# EAGLE design coms (EAGLE 7.7.0)

## Sheet 1 of 3
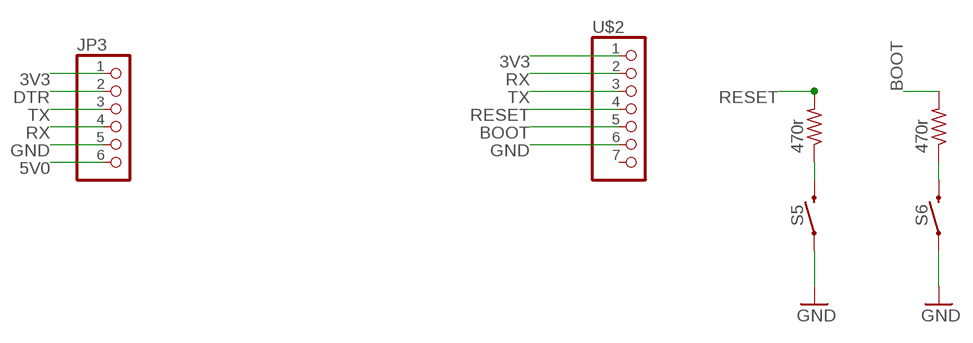
[diagram p0: schematic, sheet 1]

### Parts
JP3  HEADER-1X6ROUND  [1X06_ROUND]
R5  470r  R-US_M1206  [M1206]
R6  470r  R-US_M1206  [M1206]
S5  MOMENTARY-SWITCH-SPST  [TACTILE_SWITCH_C480275]
S6  MOMENTARY-SWITCH-SPST  [TACTILE_SWITCH_C480275]
U$2  HEADER-1X7ROUND  [1X07_ROUND]

### Nets
3V3: JP3.1 U$2.1 ; also sheet 2,3
5V0: JP3.6 ; also sheet 2,3
BOOT: R6.2 U$2.5 ; also sheet 2,3
DTR: JP3.2 ; also sheet 2,3
GND: JP3.5 S5.1 S5.2 S6.1 S6.2 U$2.6 ; also sheet 2,3
N$5: R5.1 S5.3 S5.4
N$6: R6.1 S6.3 S6.4
RESET: R5.2 U$2.4 ; also sheet 2,3
RX: JP3.4 U$2.2 ; also sheet 2,3
TX: JP3.3 U$2.3 ; also sheet 2,3
Unconnected: U$2.7

## Sheet 2 of 3
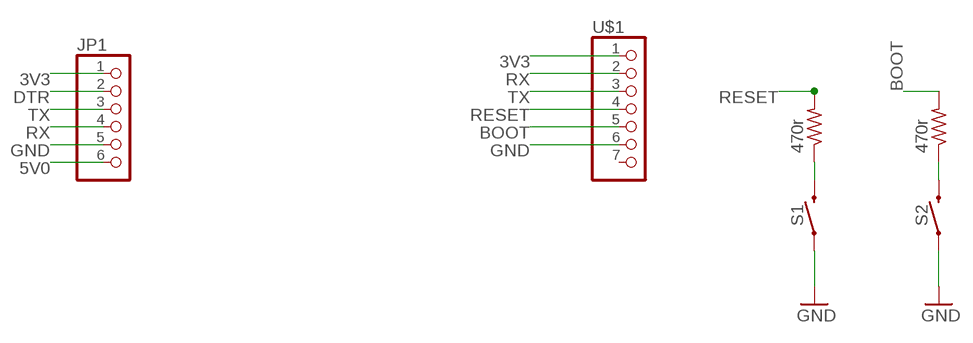
[diagram p1: schematic, sheet 2]

### Parts
JP1  HEADER-1X6ROUND  [1X06_ROUND]
R1  470r  R-US_M1206  [M1206]
R2  470r  R-US_M1206  [M1206]
S1  MOMENTARY-SWITCH-SPST  [TACTILE_SWITCH_C480275]
S2  MOMENTARY-SWITCH-SPST  [TACTILE_SWITCH_C480275]
U$1  HEADER-1X7ROUND  [1X07_ROUND]

### Nets
3V3: JP1.1 U$1.1 ; also sheet 1,3
5V0: JP1.6 ; also sheet 1,3
BOOT: R2.2 U$1.5 ; also sheet 1,3
DTR: JP1.2 ; also sheet 1,3
GND: JP1.5 S1.1 S1.2 S2.1 S2.2 U$1.6 ; also sheet 1,3
N$1: R1.1 S1.3 S1.4
N$2: R2.1 S2.3 S2.4
RESET: R1.2 U$1.4 ; also sheet 1,3
RX: JP1.4 U$1.2 ; also sheet 1,3
TX: JP1.3 U$1.3 ; also sheet 1,3
Unconnected: U$1.7

## Sheet 3 of 3
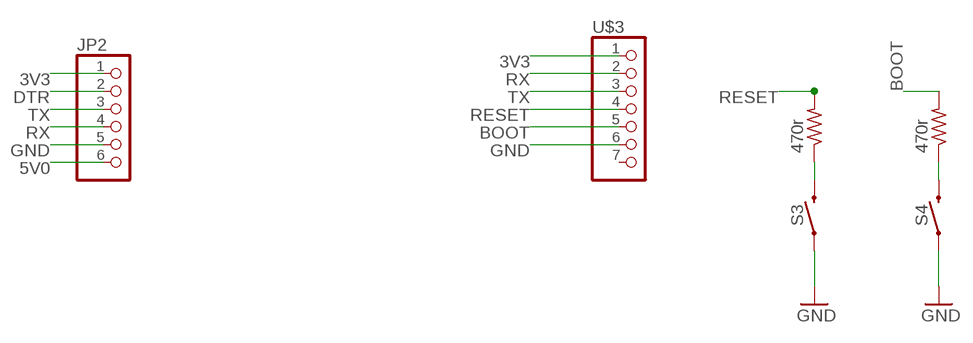
[diagram p2: schematic, sheet 3]

### Parts
JP2  HEADER-1X6ROUND  [1X06_ROUND]
R3  470r  R-US_M1206  [M1206]
R4  470r  R-US_M1206  [M1206]
S3  MOMENTARY-SWITCH-SPST  [TACTILE_SWITCH_C480275]
S4  MOMENTARY-SWITCH-SPST  [TACTILE_SWITCH_C480275]
U$3  HEADER-1X7ROUND  [1X07_ROUND]

### Nets
3V3: JP2.1 U$3.1 ; also sheet 1,2
5V0: JP2.6 ; also sheet 1,2
BOOT: R4.2 U$3.5 ; also sheet 1,2
DTR: JP2.2 ; also sheet 1,2
GND: JP2.5 S3.1 S3.2 S4.1 S4.2 U$3.6 ; also sheet 1,2
N$3: R3.1 S3.3 S3.4
N$4: R4.1 S4.3 S4.4
RESET: R3.2 U$3.4 ; also sheet 1,2
RX: JP2.4 U$3.2 ; also sheet 1,2
TX: JP2.3 U$3.3 ; also sheet 1,2
Unconnected: U$3.7

## Library data of the parts
JP1-JP3 = microbuilder:HEADER-1X6: PIN HEADER
R1-R6 = rcl:R-US_: RESISTOR, American symbol
S1-S6 = SparkFun-Switches:MOMENTARY-SWITCH-SPST: Momentary Switch (Pushbutton) - SPST Normally-open (NO) SPST momentary switches (buttons, pushbuttons). Variants PTH-12MM - 12mm square, through-hole Momentary Pushbutton Switch - 12mm Square <https://www.sparkfun.com/products/9190> (COM-09190) PTH-6.0MM, PTH-6.0MM-KIT - 6.0mm square, through-hole Mini Pushbutton Switch <https://www.sparkfun.com/products/97> (COM-00097) KIT package intended for soldering kit's - only one side of pads' copper is exposed. PTH-RIGHT-ANGLE-KIT - Right-angle, through-hole Right Angle Tactile Button <https://www.sparkfun.com/products/10791> - Used on SparkFun BigTime Watch Kit <https://www.sparkfun.com/products/11734> SMD-12MM - 12mm square, surface-mount Tactile Button - SMD (12mm) <https://www.sparkfun.com/products/12993> (COM-12993) Used on SparkFun PicoBoard <https://www.sparkfun.com/products/11888> SMD-4.5MM - 4.5mm Square Trackball Switch Used on SparkFun Blackberry Trackballer Breakout <https://www.sparkfun.com/products/13169> SMD-4.6MMX2.8MM - 4.60mm x 2.80mm, surface mount Used on SparkFun SAMD21 Mini Breakout <https://www.sparkfun.com/products/13664> SMD-5.2MM, SMD-5.2-REDUNDANT - 5.2mm square, surface-mount Mini Pushbutton Switch - SMD <https://www.sparkfun.com/products/8720> (COM-08720) Used on Arduino Pro Mini <https://www.sparkfun.com/products/11114> REDUNDANT package connects both switch circuits together SMD-6.0X3.5MM - 6.0 x 3.5mm, surface mount Momentary Reset Switch SMD <https://www.sparkfun.com/products/8229> (COM-08229) SMD-6.2MM-TALL - 6.2mm square, surface mount Tactile Button - SMD (6mm) <https://www.sparkfun.com/products/12992> Used on SparkFun Digital Sandbox <https://www.sparkfun.com/products/12651> SMD-RIGHT-ANGLE - Right-angle, surface mount Used on SparkFun Block for Intel® Edison - Arduino <https://www.sparkfun.com/products/13036>
U$1-U$3 = microbuilder:HEADER-1X7: PIN HEADER

## Net classes
0 default: width 0.254 mm, drill 0.305 mm, clearance 0.152 mm

## Board
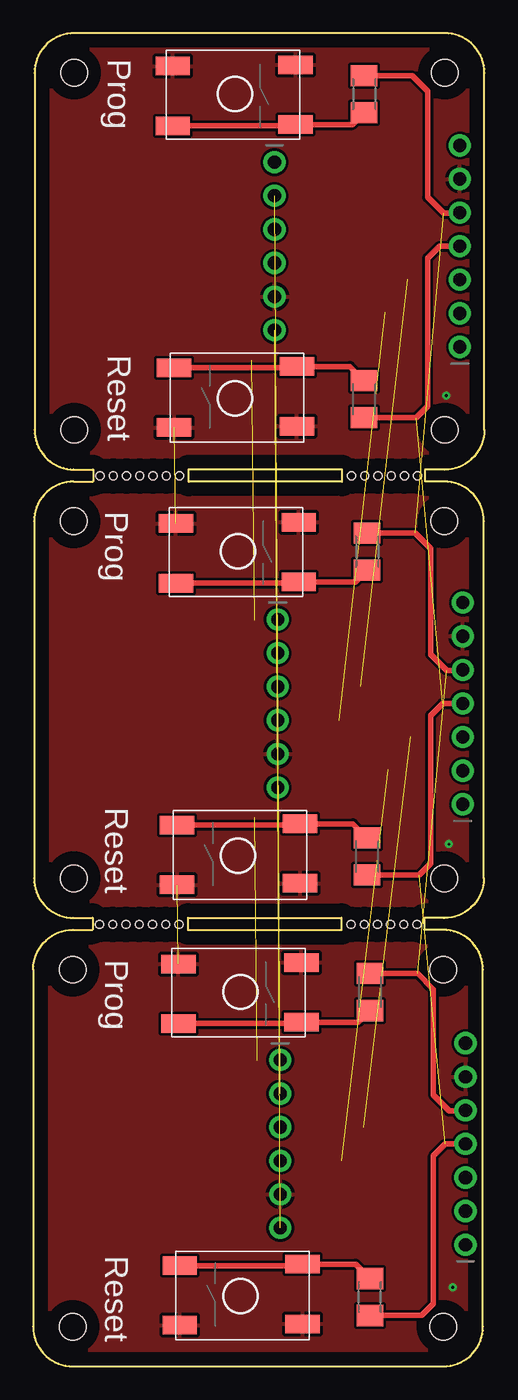
[diagram p3: board, top side]
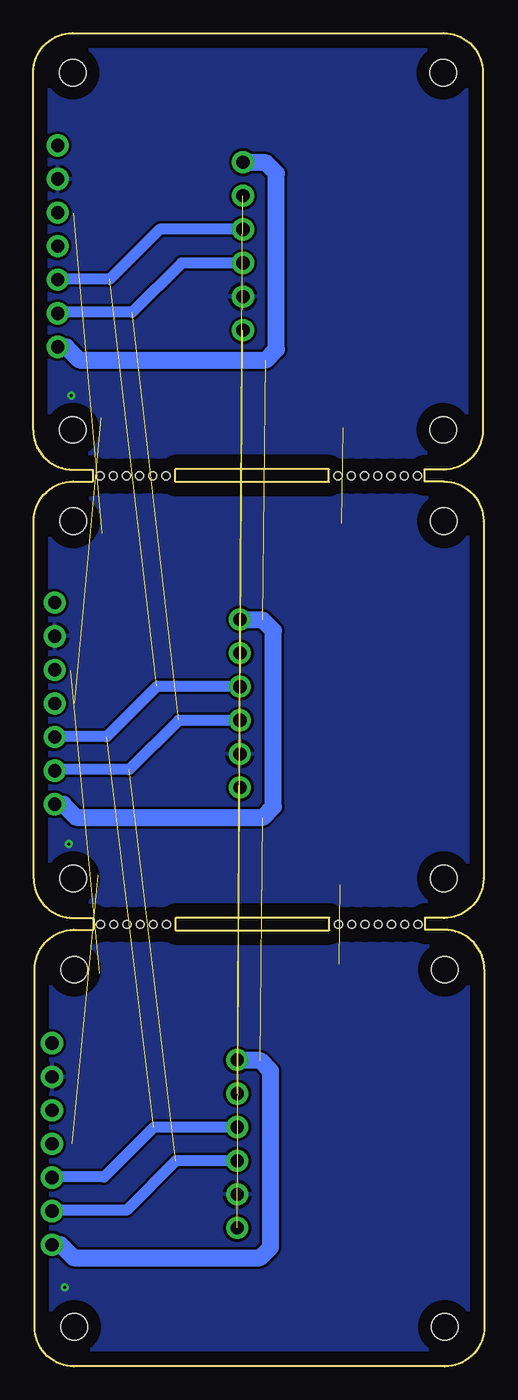
[diagram p4: board, bottom side, seen from below]

Size 34.11 x 100.8 mm. Coordinates in mm from the lower left corner, seen from the top.
Outline: 31.07,33.9 arc90 34.07,36.9 34.07,63.9 arc90 31.07,66.9
Outline: 3.07,33.9 arc-90 0.07,36.9 0.07,63.9 arc-90 3.07,66.9 4.54,66.9 4.54,67.81 3.04,67.81
Outline: 3,33.91 4.5,33.91 4.5,33 3.03,33
Outline: 11.72,32.98 11.72,33.92 23.32,33.92 23.32,32.98 11.75,32.98
Outline: 31.06,33.9 29.56,33.9 29.56,33 31.05,33
Outline: 3,33 arc90 0,30 0,3 arc90 3,0
Outline: 31,33 arc-90 34,30 34,3 arc-90 31,0 2.97,0
Outline: 31.11,67.8 arc90 34.11,70.8 34.11,97.8 arc90 31.11,100.8
Outline: 3.11,67.8 arc-90 0.11,70.8 0.11,97.8 arc-90 3.11,100.8 31.14,100.8
Outline: 11.76,66.88 11.76,67.82 23.36,67.82 23.36,66.88 11.79,66.88
Outline: 31.1,67.8 29.6,67.8 29.6,66.9 31.09,66.9
Copper layers (1*16): Top 0.035mm / dielectric 1.5mm / Bottom 0.035mm
Design rules "default": minimum track width 10mil, minimum drill 24mil, track to track 8mil, track to pad 8mil, pad to pad 8mil, via to via 8mil, smd to smd 8mil, copper to edge 40mil, drill to drill 8mil, minimum pad ring 10mil, minimum via ring 8mil, stop-mask expansion 4mil, vias tented up to drill 0mil, thermal gap 10mil
Holes 2 mm at 31.07,63.9 31.07,36.9 3.07,36.9 3.07,63.9 3,3 3,30 31,30 31,3 31.11,97.8 31.11,70.8 3.11,70.8 3.11,97.8
Holes 0.6 mm at 5.02,33.42 6.02,33.42 7.02,33.42 8.02,33.42 9.02,33.42 10.02,33.42 11.02,33.42 11.02,33.42 10.02,33.42 9.02,33.42 8.02,33.42 7.02,33.42 6.02,33.42 5.02,33.42 29.02,33.42 29.02,33.42 28.02,33.42 27.02,33.42 26.02,33.42 25.02,33.42 24.02,33.42 24.02,33.42 25.02,33.42 26.02,33.42 27.02,33.42 28.02,33.42 29.02,33.42 29.02,33.42 5.06,67.32 6.06,67.32 7.06,67.32 8.06,67.32 9.06,67.32 10.06,67.32 11.06,67.32 11.06,67.32 10.06,67.32 9.06,67.32 8.06,67.32 7.06,67.32 6.06,67.32 5.06,67.32 29.06,67.32 29.06,67.32 28.06,67.32 27.06,67.32 26.06,67.32 25.06,67.32 24.06,67.32 24.06,67.32 25.06,67.32 26.06,67.32 27.06,67.32 28.06,67.32 29.06,67.32 29.06,67.32

### Footprints (pad centres in the part's own frame; a part is rotated, then mirrored left to right if it is on the bottom)
1X06_ROUND = drill 1 pad 1.676: 1 -6.35,0; 2 -3.81,0; 3 -1.27,0; 4 1.27,0; 5 3.81,0; 6 6.35,0
M1206 = smd 1.6 x 2: 1 -1.4,0; 2 1.4,0
TACTILE_SWITCH_C480275 = smd 2.6 x 1.4: 1 -4.694,2.105; 2 4.594,2.205; 3 -4.694,-2.405; 4 4.594,-2.305
1X07_ROUND = drill 1 pad 1.676: 1 -7.62,0; 2 -5.08,0; 3 -2.54,0; 4 0,0; 5 2.54,0; 6 5.08,0; 7 7.62,0

### Placement (x,y rotation side)
JP1  18.48,50.12 270 top
JP2  18.68,16.82 270 top
JP3  18.25,84.69 270 top
R1  25.25,38.55 270 top
R2  25.25,61.6 90 top
R3  25.45,5.25 270 top
R4  25.45,28.3 90 top
R5  25.02,73.12 270 top
R6  25.02,96.17 90 top
S1  15.48,38.62 180 top
S2  15.48,61.62 0 top
S3  15.68,5.32 180 top
S4  15.68,28.32 0 top
S5  15.25,73.19 180 top
S6  15.25,96.19 0 top
U$1  32.48,50.12 90 top
U$2  32.25,84.69 90 top
U$3  32.68,16.82 90 top

### Tracks (layer width: path | path; a pad name or v marks a point on that pad's centre or on a via)
3V3  (2 unrouted)
  Bottom 1.27: U$2.1 31.6,77.07 30.62,76.09 16.52,76.09 15.72,76.89 15.72,90.19 16.52,90.99 18.2,90.99 JP3.1 | U$1.1 31.83,42.5 30.85,41.52 16.75,41.52 15.95,42.32 15.95,55.62 16.75,56.42 18.43,56.42 JP1.1 | U$3.1 32.03,9.2 31.05,8.22 16.95,8.22 16.15,9.02 16.15,22.32 16.95,23.12 18.63,23.12 JP2.1
5V0  (2 unrouted)
BOOT  (2 unrouted)
  Top 0.406: R6.2 28.64,97.57 29.82,96.39 29.82,88.39 31.02,87.19 32.21,87.19 U$2.5 | R2.2 28.87,63 30.05,61.82 30.05,53.82 31.25,52.62 32.44,52.62 U$1.5 | R4.2 29.07,29.7 30.25,28.52 30.25,20.52 31.45,19.32 32.64,19.32 U$3.5
DTR  (2 unrouted)
GND  (via drill 0.2)  (2 unrouted)
  other vias: 31.72,5.99 31.42,39.49 31.22,73.39
  pour Top: -0.78,67.42 35.82,67.42 35.82,32.82 -1.28,32.82 -1.28,66.72
  pour Bottom: -1.08,67.82 35.72,67.82 35.72,32.82 -1.38,32.82 -1.38,67.52
  pour Top: 35.85,-0.52 -0.75,-0.52 -0.75,34.08 36.35,34.08 36.35,0.18
  pour Bottom: 36.15,-0.92 -0.65,-0.92 -0.65,34.08 36.45,34.08 36.45,-0.62
  pour Top: -0.74,101.32 35.86,101.32 35.86,66.72 -1.24,66.72 -1.24,100.62
  pour Bottom: -0.68,101.81 35.44,101.07 35.76,66.72 -1.34,66.72 -1.34,101.42
N$1
  Top 0.406: S1.4 20.07,40.93 S1.3 24.18,41.02 R1.1
N$2
  Top 0.406: S2.3 19.97,59.22 S2.4 24.36,59.32 R2.1
N$3
  Top 0.406: S3.4 20.27,7.62 S3.3 24.38,7.73 R3.1
N$4
  Top 0.406: S4.3 20.17,25.91 S4.4 24.57,26.01 R4.1
N$5
  Top 0.406: S5.4 19.84,75.49 S5.3 23.95,75.59 R5.1
N$6
  Top 0.406: S6.3 19.74,93.78 S6.4 24.13,93.88 R6.1
RESET  (2 unrouted)
  Top 0.406: R5.2 28.95,71.72 29.82,72.59 29.82,83.79 30.72,84.69 U$2.4 | R1.2 29.18,37.15 30.05,38.02 30.05,49.22 30.95,50.12 U$1.4 | R3.2 29.38,3.85 30.25,4.72 30.25,15.92 31.15,16.82 U$3.4
RX  (2 unrouted)
  Bottom 0.813: JP3.4 22.89,83.42 26.62,79.69 32.17,79.69 U$2.2 | JP1.4 23.12,48.85 26.85,45.12 32.4,45.12 U$1.2 | JP2.4 23.32,15.55 27.05,11.82 32.6,11.82 U$3.2
TX  (2 unrouted)
  Bottom 0.813: JP3.3 24.55,85.96 28.32,82.19 32.21,82.19 U$2.3 | JP1.3 24.78,51.39 28.55,47.62 32.44,47.62 U$1.3 | JP2.3 24.98,18.09 28.75,14.32 32.64,14.32 U$3.3

### Text on the board
_tsilk: Prog | Reset | Prog | Reset | Prog | Reset